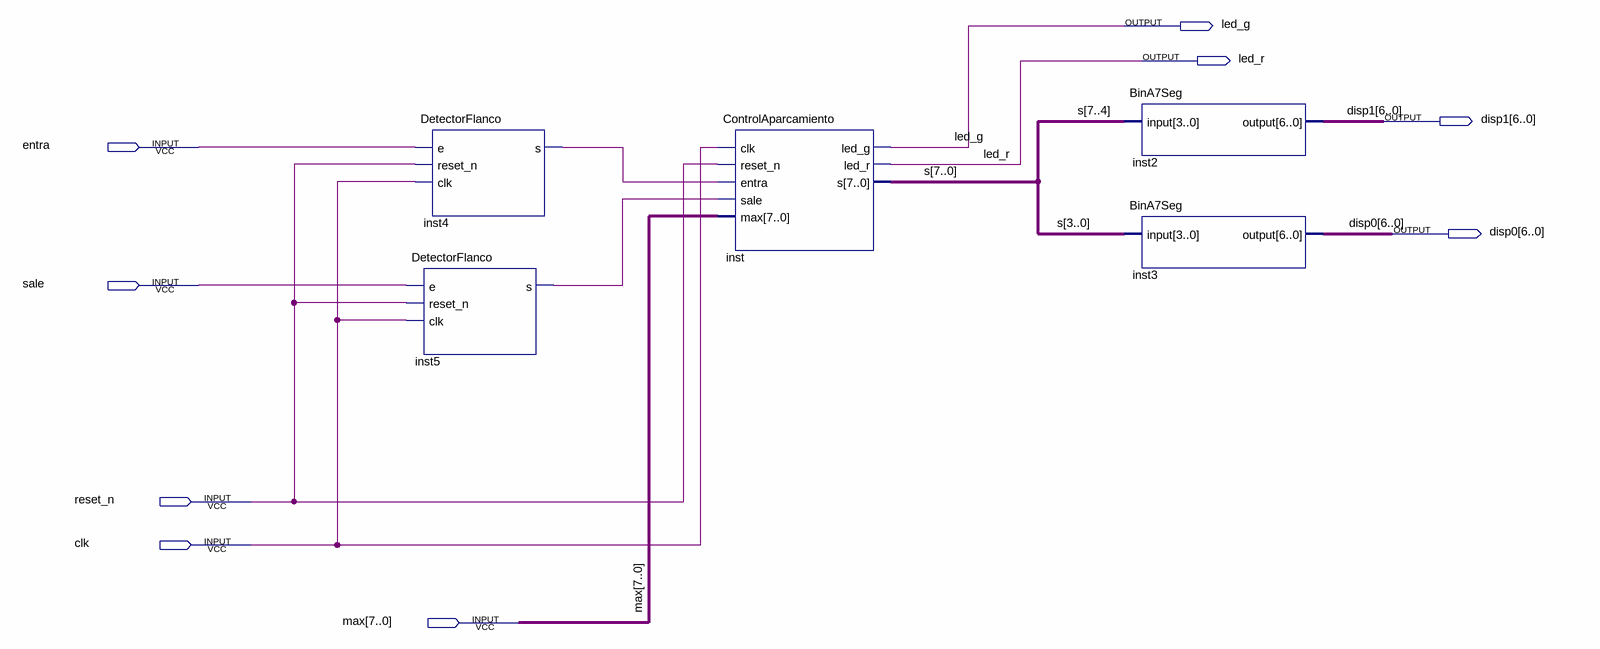
[diagram p0: schematic sheet]
// Quartus schematic Practica10.bdf as structural Verilog: 5 symbols, 9 pins
module Practica10 (
  input  entra,
  input  sale,
  input  reset_n,
  input  clk,
  input  [7:0] max,
  output led_g,
  output led_r,
  output [6:0] disp1,
  output [6:0] disp0
);

  wire inst4_s, inst5_s;
  wire [7:0] s;

  DetectorFlanco inst4 (.e(entra), .reset_n(reset_n), .clk(clk), .s(inst4_s));
  DetectorFlanco inst5 (.e(sale), .reset_n(reset_n), .clk(clk), .s(inst5_s));
  ControlAparcamiento inst (
    .clk(clk), .reset_n(reset_n), .entra(inst4_s), .sale(inst5_s), .max(max), .led_g(led_g), .led_r(led_r),
    .s(s));
  BinA7Seg inst2 (.\input (s[7:4]), .\output (disp1));
  BinA7Seg inst3 (.\input (s[3:0]), .\output (disp0));
endmodule
